# EAGLE schematic PCB-ARD-DUEBOS_2016 (EAGLE 7.5.0)
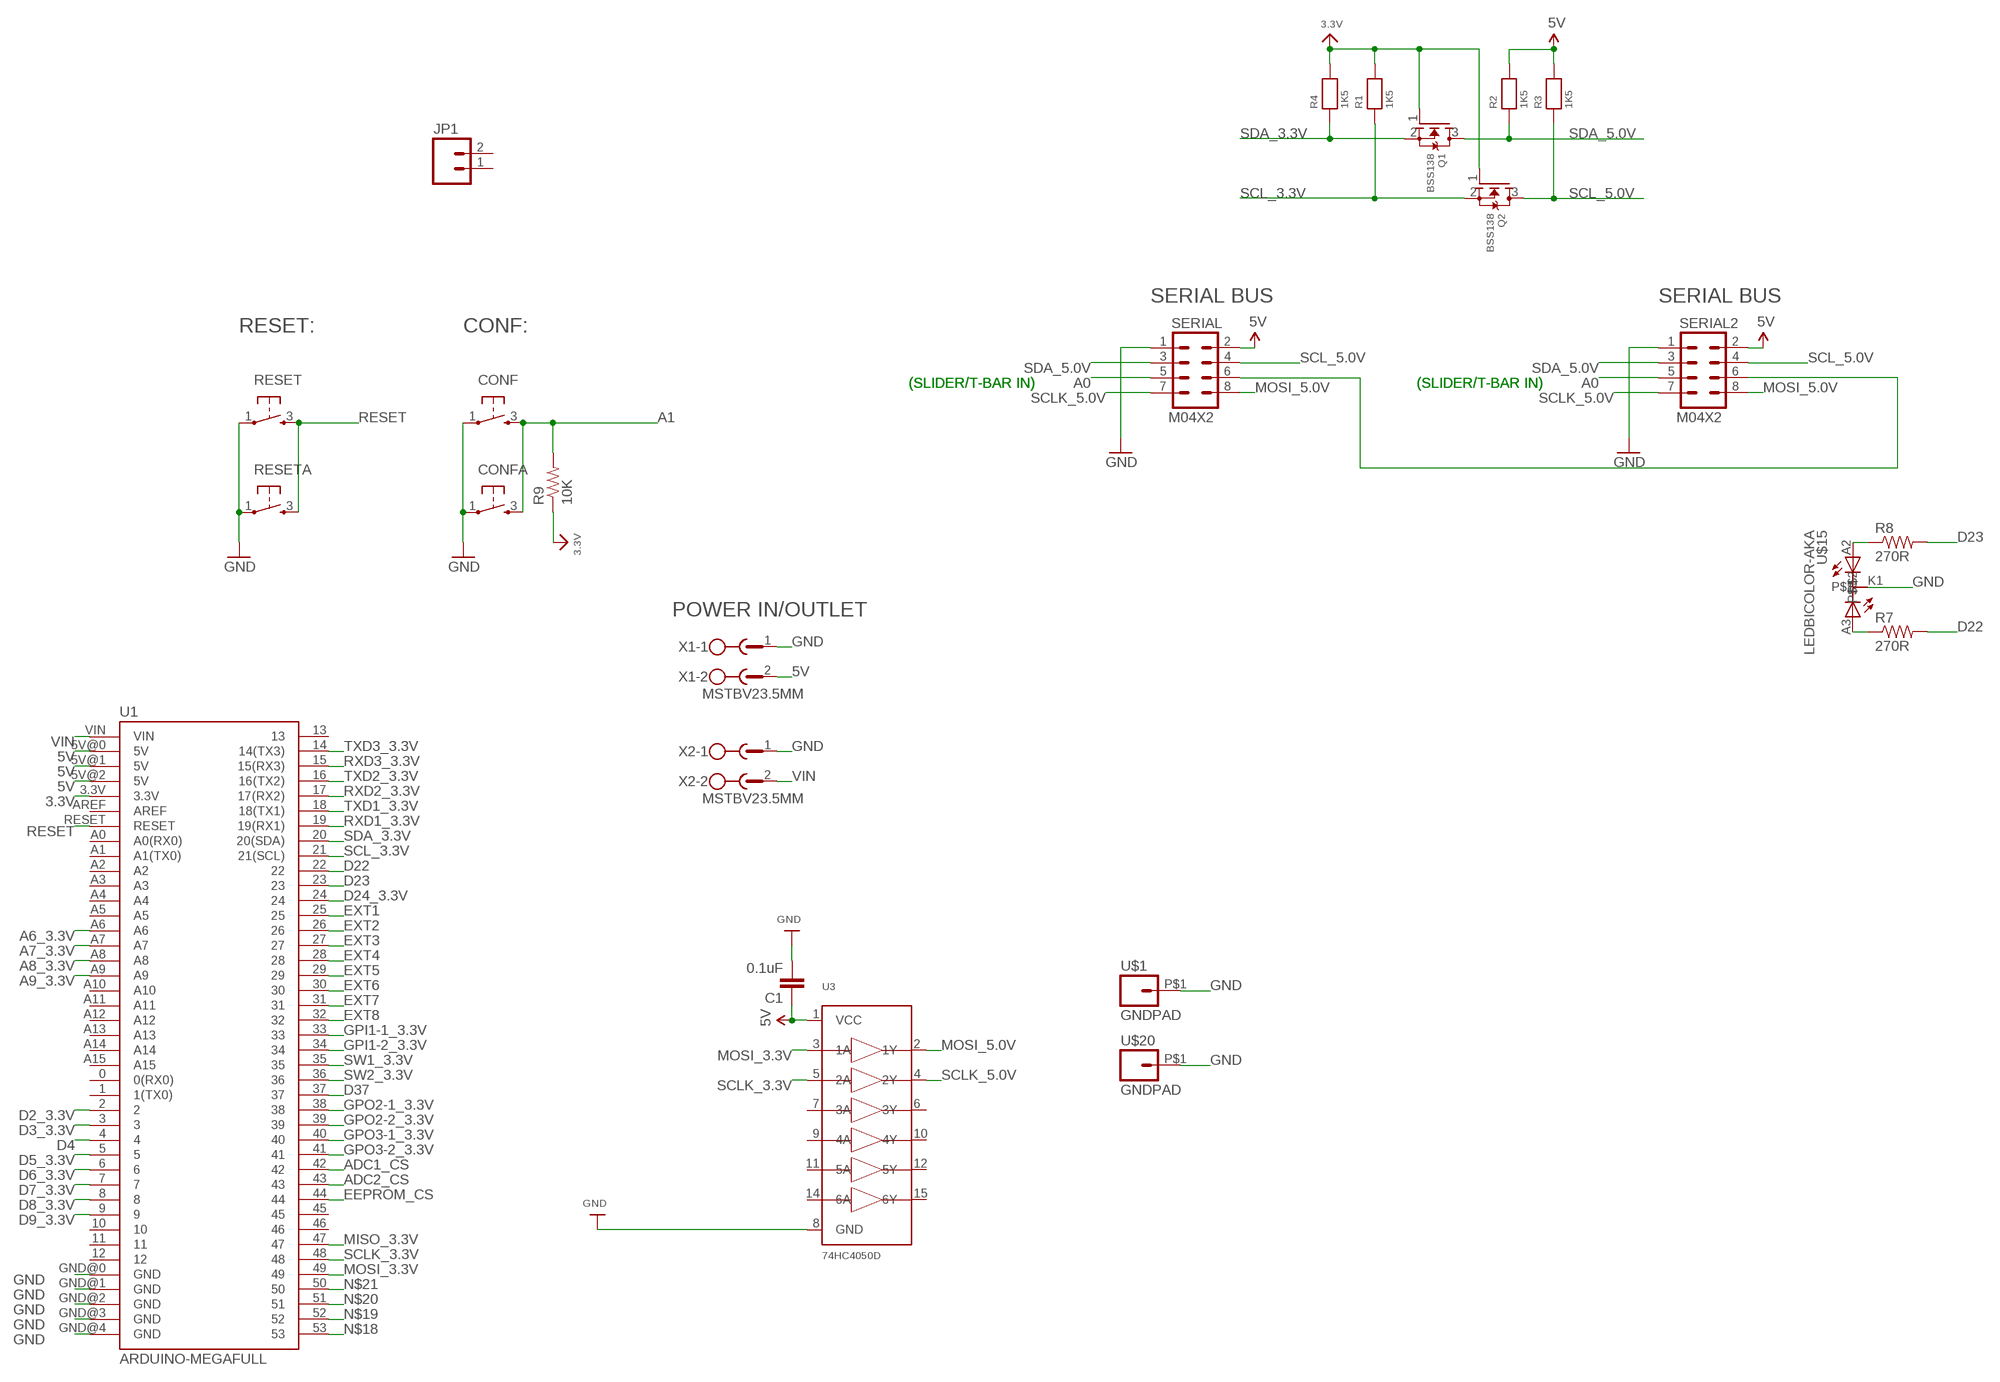
[diagram p0: schematic, sheet 1]

## Parts
C1  0.1uF  CAP0603-CAP  [0603-CAP]
CONF  TAC_SWITCH  [PUSHBUTTON]
CONFA  TAC_SWITCH  [PUSHBUTTON]
JP1  M02PTH  [1X02]
Q1  BSS138  MOSFET-NREFLOW  [SOT23-R]
Q2  BSS138  MOSFET-NREFLOW  [SOT23-R]
R1  1K5  RESISTOR0603  [0603]
R2  1K5  RESISTOR0603  [0603]
R3  1K5  RESISTOR0603  [0603]
R4  1K5  RESISTOR0603  [0603]
R7  270R  RESISTOR0603-RES  [0603-RES]
R8  270R  RESISTOR0603-RES  [0603-RES]
R9  10K  RESISTOR0603-RES  [0603-RES]
RESET  TAC_SWITCH  [PUSHBUTTON]
RESETA  TAC_SWITCH  [PUSHBUTTON]
SERIAL  M04X2  [2X4]
SERIAL2  M04X2  [2X4]
U1  ARDUINO-MEGAFULL  [ARDUINO_MEGA]
U3  74HC4050D  74HC4050DTSSOP16  [TSSOP16]
U$1  GNDPAD  [3.2MMPAD]
U$15  LEDBICOLOR-AKA  [LED5MM-BICOLOR]
U$20  GNDPAD  [3.2MMPAD]
X1  MSTBV23.5MM  [MSTBV2-3.5]
X2  MSTBV23.5MM  [MSTBV2-3.5]

## Nets
3.3V [Power]: Q1.1(G) Q2.1(G) R1.2 R4.2 R9.1 U1.3.3V
5V [Power]: C1.1 R2.2 R3.2 SERIAL2.2 SERIAL.2 U1.5V@0(5V) U1.5V@1(5V) U1.5V@2(5V) U3.1(VCC) X1.2
A0: SERIAL2.5 SERIAL.5
A1: CONF.3 CONFA.3 R9.2
A6_3.3V: U1.A6
A7_3.3V: U1.A7
A8_3.3V: U1.A8
A9_3.3V: U1.A9
ADC1_CS: U1.42
ADC2_CS: U1.43
D2_3.3V: U1.2
D3_3.3V: U1.3
D4: U1.4
D5_3.3V: U1.5
D6_3.3V: U1.6
D7_3.3V: U1.7
D8_3.3V: U1.8
D9_3.3V: U1.9
D22: R7.2 U1.22
D23: R8.2 U1.23
D24_3.3V: U1.24
D37: U1.37
EEPROM_CS: U1.44
EXT1: U1.25
EXT2: U1.26
EXT3: U1.27
EXT4: U1.28
EXT5: U1.29
EXT6: U1.30
EXT7: U1.31
EXT8: U1.32
GND [Power]: C1.2 CONF.1 CONFA.1 RESET.1 RESETA.1 SERIAL2.1 SERIAL.1 U1.GND@0(GND) U1.GND@1(GND) U1.GND@2(GND) U1.GND@3(GND) U1.GND@4(GND) U3.8(GND) U$1.P$1 U$15.K1 U$20.P$1 X1.1 X2.1
GPI1-1_3.3V: U1.33
GPI1-2_3.3V: U1.34
GPO2-1_3.3V: U1.38
GPO2-2_3.3V: U1.39
GPO3-1_3.3V: U1.40
GPO3-2_3.3V: U1.41
MISO_3.3V: U1.47
MOSI_3.3V: U1.49 U3.3(1A)
MOSI_5.0V: SERIAL2.8 SERIAL.8 U3.2(1Y)
N$7: SERIAL2.6 SERIAL.6
N$8: R8.1 U$15.A2
N$11: R7.1 U$15.A3
N$18: U1.53
N$19: U1.52
N$20: U1.51
N$21: U1.50
RESET: RESET.3 RESETA.3 U1.RESET
RXD1_3.3V: U1.19(19(RX1))
RXD2_3.3V: U1.17(17(RX2))
RXD3_3.3V: U1.15(15(RX3))
SCL_3.3V: Q2.2(S) R1.1 U1.21(21(SCL))
SCL_5.0V: Q2.3(D) R3.1 SERIAL2.4 SERIAL.4
SCLK_3.3V: U1.48 U3.5(2A)
SCLK_5.0V: SERIAL2.7 SERIAL.7 U3.4(2Y)
SDA_3.3V: Q1.2(S) R4.1 U1.20(20(SDA))
SDA_5.0V: Q1.3(D) R2.1 SERIAL2.3 SERIAL.3
SW1_3.3V: U1.35
SW2_3.3V: U1.36
TXD1_3.3V: U1.18(18(TX1))
TXD2_3.3V: U1.16(16(TX2))
TXD3_3.3V: U1.14(14(TX3))
VIN [Power]: U1.VIN X2.2
Unconnected: JP1.1 JP1.2 U1.0(0(RX0)) U1.1(1(TX0)) U1.10 U1.11 U1.12 U1.13 U1.45 U1.46 U1.A0(A0(RX0)) U1.A1(A1(TX0)) U1.A2 U1.A3 U1.A4 U1.A5 U1.A10 U1.A11 U1.A12 U1.A13 U1.A14 U1.A15 U1.AREF U3.6(3Y) U3.7(3A) U3.9(4A) U3.10(4Y) U3.11(5A) U3.12(5Y) U3.14(6A) U3.15(6Y)

## Notes on the sheet
- SERIAL BUS | SERIAL BUS
- RESET: | CONF:
- (SLIDER/T-BAR IN) | (SLIDER/T-BAR IN) | (SLIDER/T-BAR IN) | (SLIDER/T-BAR IN)
- POWER IN/OUTLET

## Library data of the parts
C1 = SparkFun:CAP: Capacitor Standard 0603 ceramic capacitor, and 0.1" leaded capacitor.
CONF CONFA RESET RESETA = SKAARHOJ:TAC_SWITCH: Momentary Switch Button commonly used for reset or general input. Spark Fun Electronics SKU : COM-00097
JP1 = SparkFun:M02: Header 2 Standard 2-pin 0.1" header. Use with straight break away headers (SKU : PRT-00116), right angle break away headers (PRT-00553), swiss pins (PRT-00743), machine pins (PRT-00117), and female headers (PRT-00115). Molex polarized connector foot print use with SKU : PRT-08233 with associated crimp pins and housings.
Q1 Q2 = microbuilder:MOSFET-N: N-Channel Mosfet LEGEND VDS: Voltage Drain-Source ID: Drain Current RDS(ON): Drain-Source On-State Resistance VGS(TH): Gate-Source Threshold Voltage CISS: Drain-Source Input Capacitance SOT-23 Name VDS ID RDS(ON) VGS(TH) CISS Order Number 2N7002E 60V 260mA 2.5 Ohm 2.5V @ 250uA 26.7pF @ 25V 2N7002ET1GOSTR-ND BSH103 30V 850mA 400 mOhm 400mV @ 1mA 83pF @ 24V BSH103,235-ND BSS138 60V 320mA 1.6 Ohm 1.5V @ 250uA 50pF @ 10V Mouser: 771-BSS138PW115 DMN2075U-7 20V 4.2A 38 mOhm 1V @ 250 uA 594.3pF @ 10V DMN2075U-7DICT-ND * BSS138 good choice for I2C level-shifting
R1-R4 = microbuilder:RESISTOR: Resistors 0402 - 0402 Surface Mount Package 22 Ohm 1% 1/16W [Digikey: 311-22.0LRTR-ND] 33 Ohm 5% 1/16W 1.0K 5% 1/16W 1.5K 5% 1/16W 2.0K 1% 1/16W 10.0K 1% 1/16W [Digikey: 311-10.0KLRTR-ND] 10.0K 5% 1/16W [Digikey: RMCF0402JT10K0TR-ND] 12.1K 1% 1/16W [Digikey: 311-22.0LRTR-ND] 100.0K 5% 1/16W 0603 - 0603 Surface Mount Package 0 Ohm 1/10 Watt 1% Resistor 15 Ohm 1/10 Watt 1% Resistor 33 Ohm 1/10 Watt 1% Resistor 49.9 Ohm 1/10 Watt 1% Resistor 100 Ohm 1/10 Watt 1% Resistor 150 Ohm 1/10 Watt 1% Resistor 240 Ohm 1/10 Watt 1% Resistor 390 Ohm 1/10 Watt 1% Resistor 560 Ohm 1/10 Watt 1% Resistor 680 Ohm 1/10 Watt 1% Resistor 750 Ohm 1/10 Watt 1% Resistor 1.0K Ohm 1/10 Watt 1% Resistor 1.5K Ohm 1/10 Watt 1% Resistor 2.0K Ohm 1/10 Watt 1% Resistor 2.2K Ohm 1/10 Watt 1% Resistor 3.3K Ohm 1/10 Watt 1% Resistor 4.7K Ohm 1/10 Watt 1% Resistor 10.0K Ohm 1/10 Watt 1% Resistor 12.0K Ohm 1/10 Watt 1% Resistor 12.1K Ohm 1/10 Watt 1% Resistor 20.0K Ohm 1/10 Watt 1% Resistor 33.0K Ohm 1/10 Watt 1% Resistor 100.0K Ohm 1/10 Watt 1% Resistor 0805 - 0805 Surface Mount Package 0 Ohm 1/8 Watt 1% Resistor 33 Ohm 1/8 Watt 1% Resistor 100 Ohm 1/8 Watt 1% Resistor 150 Ohm 1/8 Watt 1% Resistor 200 Ohm 1/8 Watt 1% Resistor 240 Ohm 1/8 Watt 1% Resistor 330 Ohm 1/8 Watt 1% Resistor 390 Ohm 1/8 Watt 1% Resistor 470 Ohm 1/8 Watt 1% Resistor 1.0K Ohm 1/8 Watt 1% Resistor 1.5K Ohm 1/8 Watt 1% Resistor 2.0K Ohm 1/8 Watt 1% Resistor 4.7K Ohm 1/8 Watt 1% Resistor 5.1K Ohm 1/8 Watt 1% Resistor 5.6K Ohm 1/8 Watt 1% Resistor 10.0K Ohm 1/8 Watt 1% Resistor 22.0K Ohm 1/8 Watt 1% Resistor 33.0K Ohm 1/8 Watt 1% Resistor 100K Ohm 1/8 Watt 1% Resistor 1206 - 1206 Surface Mount Package 2012 - 2010 Surface Mount Package 0.11 Ohm 1/2 Watt 1% Resistor - Digikey: RHM.11UCT-ND
R7-R9 = SparkFun:RESISTOR: Resistor Basic schematic elements and footprints for 0603, 1206, and PTH resistors.
SERIAL SERIAL2 = SparkFun:M04X2
U1 = SKAARHOJ:ARDUINO-MEGA: Arduino Mega footprint connections
U3 = SKAARHOJ:74HC4050D: 6-channel level shifter 74HC4050D - 2V-6V Supply Digikey: 74HC4050D,653-ND Mouser: 771-74HC4050D-T
U$1 U$20 = SKAARHOJ:GNDPAD
U$15 = SKAARHOJ:LEDBICOLOR-AKA
X1 X2 = SKAARHOJ:MSTBV2: PHOENIX

## Net classes
0 default: width 0.203 mm, drill 0.305 mm, clearance 0.152 mm
1 Power: width 0.508 mm, drill 0.61 mm, clearance 0.254 mm